# Altium schematic sheet PID.SchDoc
size A2
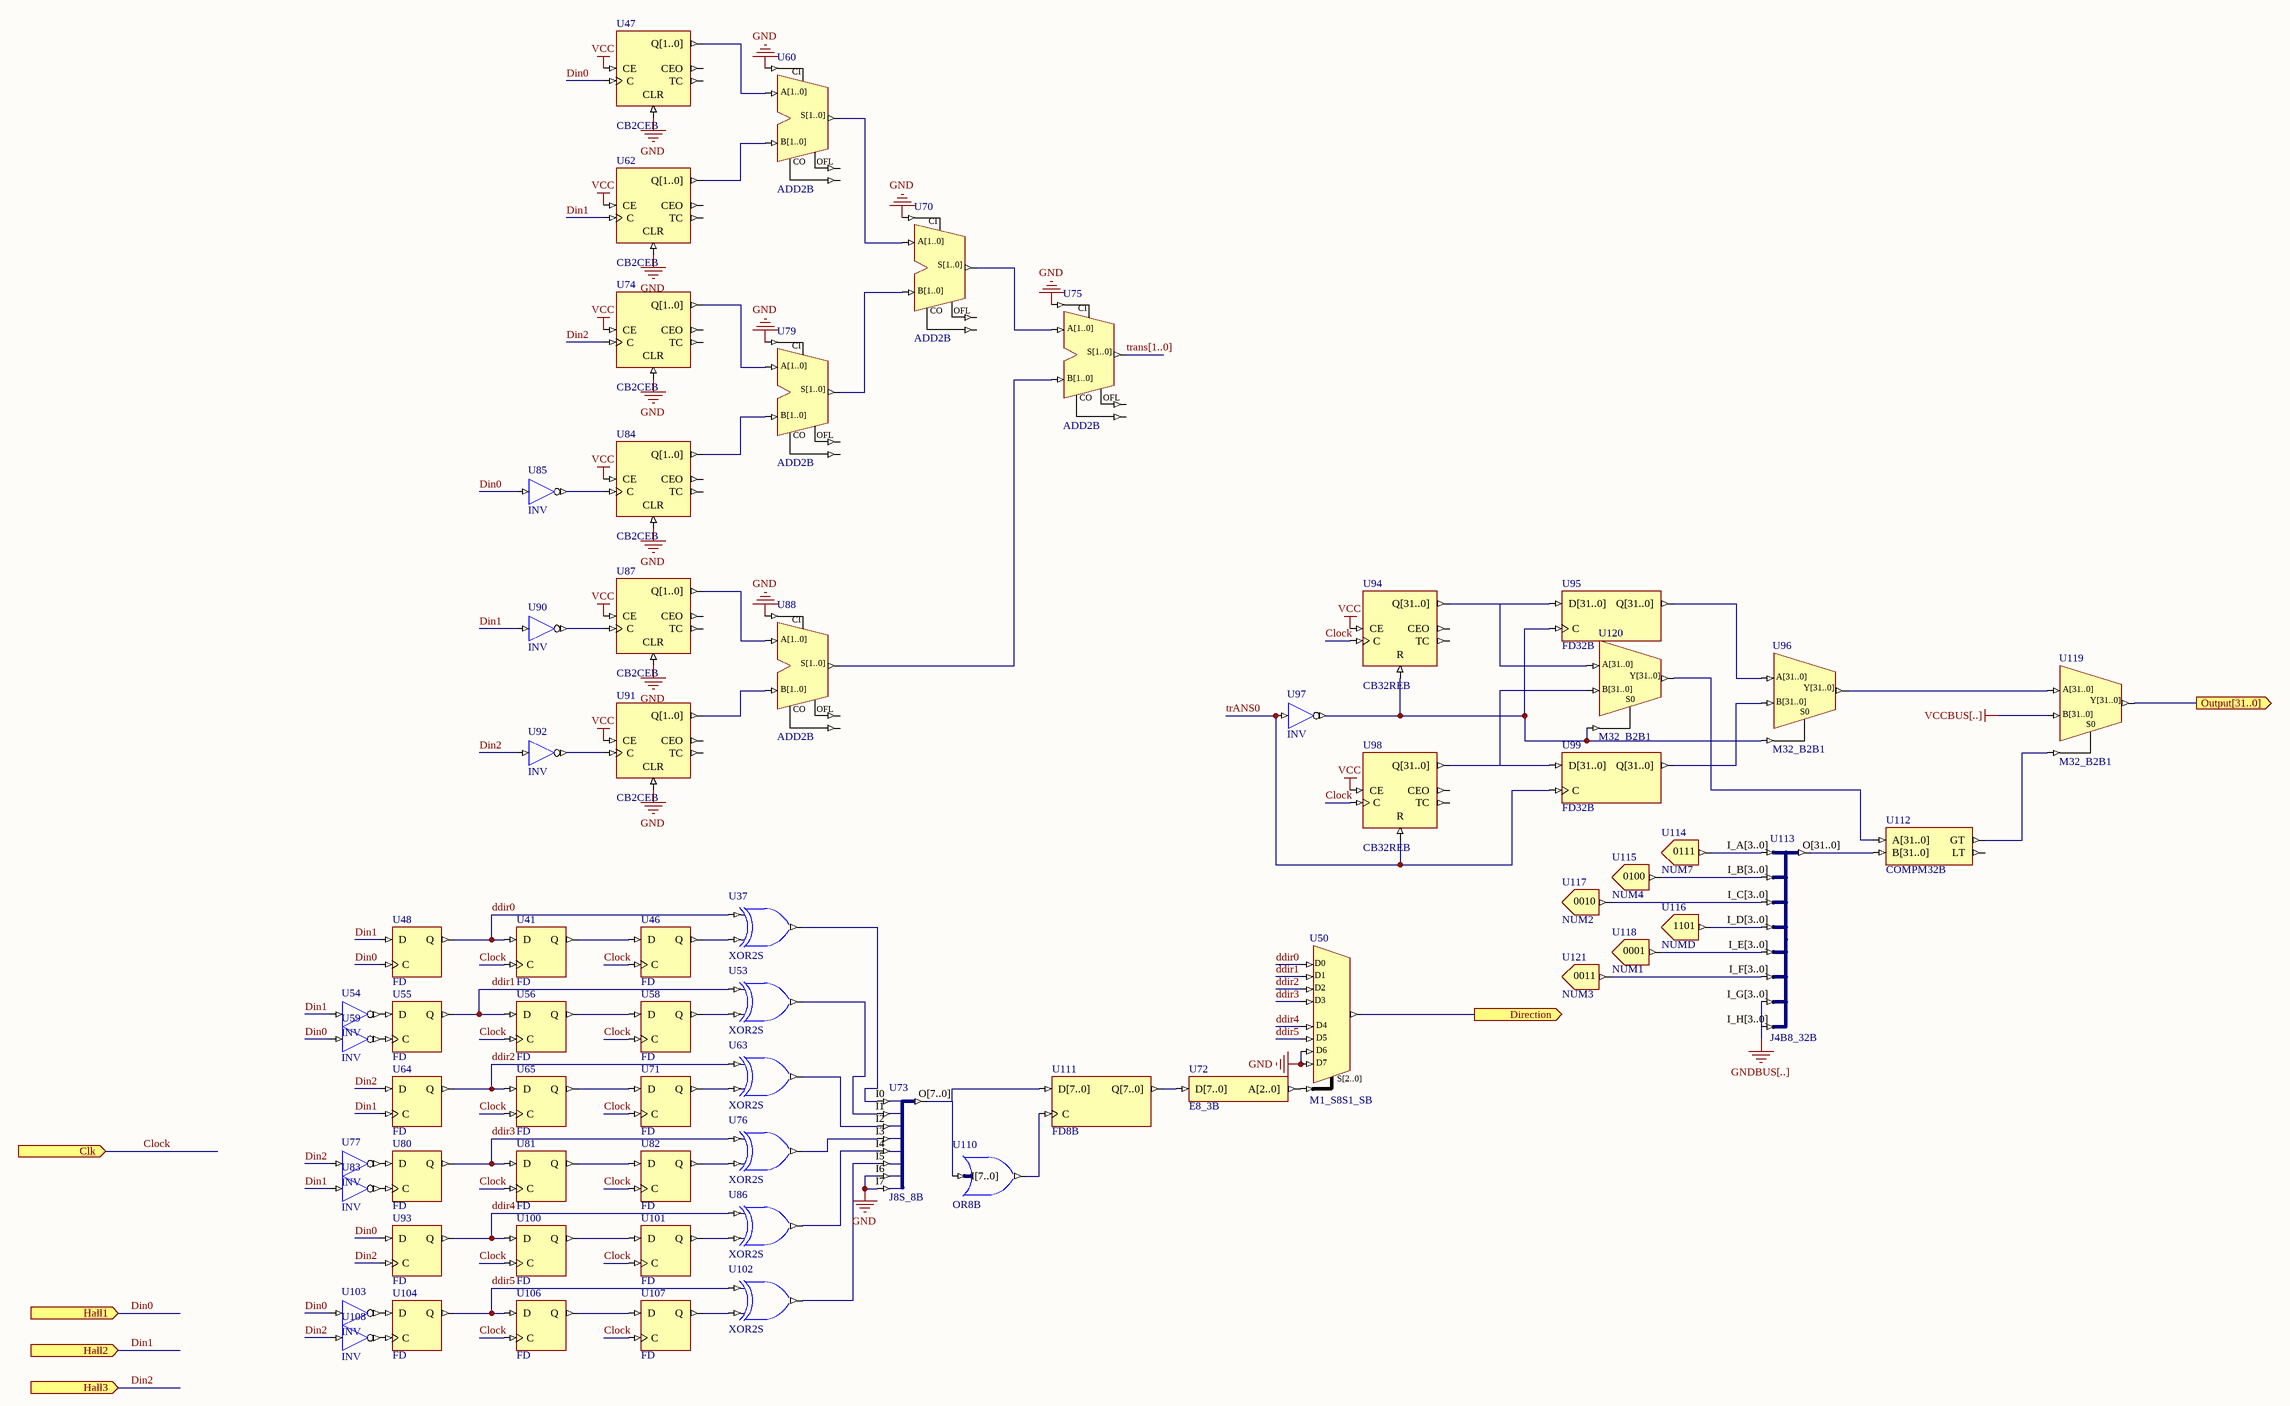
[diagram p0: PID.SchDoc]

## Parts
U37  XOR2S
U41  FD
U46  FD
U47  CB2CEB
U48  FD
U50  M1_S8S1_SB
U53  XOR2S
U54  INV
U55  FD
U56  FD
U58  FD
U59  INV
U60  ADD2B
U62  CB2CEB
U63  XOR2S
U64  FD
U65  FD
U70  ADD2B
U71  FD
U72  E8_3B
U73  J8S_8B
U74  CB2CEB
U75  ADD2B
U76  XOR2S
U77  INV
U79  ADD2B
U80  FD
U81  FD
U82  FD
U83  INV
U84  CB2CEB
U85  INV
U86  XOR2S
U87  CB2CEB
U88  ADD2B
U90  INV
U91  CB2CEB
U92  INV
U93  FD
U94  CB32REB
U95  FD32B
U96  M32_B2B1
U97  INV
U98  CB32REB
U99  FD32B
U100  FD
U101  FD
U102  XOR2S
U103  INV
U104  FD
U106  FD
U107  FD
U108  INV
U110  OR8B
U111  FD8B
U112  COMPM32B
U113  J4B8_32B
U114  NUM7
U115  NUM4
U116  NUMD
U117  NUM2
U118  NUM1
U119  M32_B2B1
U120  M32_B2B1
U121  NUM3

## Ports
Clk (in), Direction (out), Hall1 (in), Hall2 (in), Hall3 (in), Output[31..0] (out)

## Nets
GND: U47.CLR U50.D6 U50.D7 U60.CI U62.CLR U70.CI U73.I6 U73.I7 U74.CLR U75.CI U79.CI U84.CLR U87.CLR U88.CI U91.CLR
GNDBUS[..]: U113.I_G[3..0] U113.I_H[3..0]
VCC: U47.CE U62.CE U74.CE U84.CE U87.CE U91.CE U94.CE U98.CE
VCCBUS[..]: U119.B[31..0]
Clock: U41.C U46.C U56.C U58.C U65.C U71.C U81.C U82.C U94.C U98.C U100.C U101.C U106.C U107.C ; port Clk
ddir0: U37.I0 U41.D U48.Q U50.D0
ddir1: U50.D1 U53.I0 U55.Q U56.D
ddir2: U50.D2 U63.I0 U64.Q U65.D
ddir3: U50.D3 U76.I0 U80.Q U81.D
ddir4: U50.D4 U86.I0 U93.Q U100.D
ddir5: U50.D5 U102.I0 U104.Q U106.D
Din0: U47.C U48.C U59.I U85.I U93.D U103.I ; port Hall1
Din1: U48.D U54.I U62.C U64.C U83.I U90.I ; port Hall2
Din2: U64.D U74.C U77.I U92.I U93.C U108.I ; port Hall3
Direction: U50.O ; port Direction
Output[31..0]: U119.Y[31..0] ; port Output[31..0]
trANS0: U97.I U98.R U99.C
trans[1..0]: U75.S[1..0]
NetU37_I1: U37.I1 U46.Q
NetU37_O: U37.O U73.I0
NetU41_Q: U41.Q U46.D
NetU47_Q[1..0]: U47.Q[1..0] U60.A[1..0]
NetU50_S[2..0]: U50.S[2..0] U72.A[2..0]
NetU53_I1: U53.I1 U58.Q
NetU53_O: U53.O U73.I1
NetU54_O: U54.O U55.D
NetU55_C: U55.C U59.O
NetU56_Q: U56.Q U58.D
NetU60_B[1..0]: U60.B[1..0] U62.Q[1..0]
NetU60_S[1..0]: U60.S[1..0] U70.A[1..0]
NetU63_I1: U63.I1 U71.Q
NetU63_O: U63.O U73.I2
NetU65_Q: U65.Q U71.D
NetU70_B[1..0]: U70.B[1..0] U79.S[1..0]
NetU70_S[1..0]: U70.S[1..0] U75.A[1..0]
NetU72_D[7..0]: U72.D[7..0] U111.Q[7..0]
NetU73_I3: U73.I3 U76.O
NetU73_I4: U73.I4 U86.O
NetU73_I5: U73.I5 U102.O
NetU73_O[7..0]: U73.O[7..0] U110.I[7..0] U111.D[7..0]
NetU74_Q[1..0]: U74.Q[1..0] U79.A[1..0]
NetU75_B[1..0]: U75.B[1..0] U88.S[1..0]
NetU76_I1: U76.I1 U82.Q
NetU77_O: U77.O U80.D
NetU79_B[1..0]: U79.B[1..0] U84.Q[1..0]
NetU80_C: U80.C U83.O
NetU81_Q: U81.Q U82.D
NetU84_C: U84.C U85.O
NetU86_I1: U86.I1 U101.Q
NetU87_C: U87.C U90.O
NetU87_Q[1..0]: U87.Q[1..0] U88.A[1..0]
NetU88_B[1..0]: U88.B[1..0] U91.Q[1..0]
NetU91_C: U91.C U92.O
NetU94_Q[31..0]: U94.Q[31..0] U95.D[31..0] U120.A[31..0]
NetU94_R: U94.R U95.C U96.S0 U97.O U120.S0
NetU95_Q[31..0]: U95.Q[31..0] U96.A[31..0]
NetU96_B[31..0]: U96.B[31..0] U99.Q[31..0]
NetU96_Y[31..0]: U96.Y[31..0] U119.A[31..0]
NetU98_Q[31..0]: U98.Q[31..0] U99.D[31..0] U120.B[31..0]
NetU100_Q: U100.Q U101.D
NetU102_I1: U102.I1 U107.Q
NetU103_O: U103.O U104.D
NetU104_C: U104.C U108.O
NetU106_Q: U106.Q U107.D
NetU110_O: U110.O U111.C
NetU112_A[31..0]: U112.A[31..0] U120.Y[31..0]
NetU112_B[31..0]: U112.B[31..0] U113.O[31..0]
NetU112_GT: U112.GT U119.S0
NetU113_I_A[3..0]: U113.I_A[3..0] U114.O[3..0]
NetU113_I_B[3..0]: U113.I_B[3..0] U115.O[3..0]
NetU113_I_C[3..0]: U113.I_C[3..0] U117.O[3..0]
NetU113_I_D[3..0]: U113.I_D[3..0] U116.O[3..0]
NetU113_I_E[3..0]: U113.I_E[3..0] U118.O[3..0]
NetU113_I_F[3..0]: U113.I_F[3..0] U121.O[3..0]

Not connected (* = marked no-connect by the designer): U47 CEO TC; U60 CO OFL; U62 CEO TC; U70 CO OFL; U74 CEO TC; U75 CO OFL; U79 CO OFL; U84 CEO TC; U87 CEO TC; U88 CO OFL; U91 CEO TC; U94 CEO TC; U98 CEO TC; U112 LT

## Buses and harness runs
bus trans[1..0]

## Notes on the sheet
- (in symbol NUM1) 0001
- (in symbol NUM2) 0010
- (in symbol NUM3) 0011
- (in symbol NUM4) 0100
- (in symbol NUM7) 0111
- (in symbol NUMD) 1101

## Library data of the parts
U37 U53 U63 U76 U86 U102 = XOR2: 2-Input Exclusive-OR Gate, Single Pin Version; XilinxEquivalent: XOR2; FunctionalClass: Logic Primitive; SubClass: XOR; PortSize: 2; ArchiveName: GENERIC; VHDLIB_SIM: GENERIC_LIB; Published: 29-Jan-2004; Publisher: Altium Limited; LastRevisionNo: 1.00.00; HelpURL: CR0118 FPGA Generic Library Guide.pdf#page=448; ComponentLink1URL: CR0136 FPGA Logic Primitive Resource Usage.pdf#page=301; ComponentLink1Description: Core &Resource Usage; PortStyle: Single Pin Version
U41 U46 U48 U55 U56 U58 U64 U65 U71 U80-U82 U93 U100 U101 U104 U106 U107 = FD: D-Type Flip-Flop; ClockTrigger: Rising; ArchiveName: GENERIC; VHDLIB_SIM: GENERIC_LIB; Published: 29-Jan-2004; Publisher: Altium Limited; XilinxEquivalent: FD; LastRevisionNo: 1.00.00; HelpURL: CR0118 FPGA Generic Library Guide.pdf#page=170; ComponentLink1URL: CR0133 FPGA Flip Flop Resource Usage.pdf#page=4; ComponentLink1Description: Core &Resource Usage; FunctionalClass: Flip-Flop; SubClass: FD
U47 U62 U74 U84 U87 U91 = CB2CEB: 2-Bit Cascadable Binary Counters with Clock Enable and Asynchronous Clear, Bus Version; ClockTrigger: Rising; Enable: High; PortSize: 2; ArchiveName: GENERIC; VHDLIB_SIM: GENERIC_LIB; Published: 29-Jan-2004; Publisher: Altium Limited; LastRevisionNo: 1.00.00; HelpURL: CR0118 FPGA Generic Library Guide.pdf#page=128; ComponentLink1URL: CR0130 FPGA Counter Resource Usage.pdf#page=3; ComponentLink1Description: Core &Resource Usage; FunctionalClass: Counter; SubClass: Binary; Reset: Asynchronous; PortType: Bus Version
U50 = M1_S8S1_SB: 8x1-Single Wire to 1x1-Single Wire Multiplexer With Bus Version Select; SubClass: SnS1; BusBusSelect: True; PortSize: 1; PortStyle: Single Pin Version; ArchiveName: GENERIC; VHDLIB_SIM: GENERIC_LIB; Published: 31-May-2004; Publisher: Altium Limited; LastRevisionNo: 1.00.00; HelpURL: CR0118 FPGA Generic Library Guide.pdf#page=379; ComponentLink1URL: CR0137 FPGA Multiplexer Resource Usage.pdf#page=57; ComponentLink1Description: Core &Resource Usage; FunctionalClass: Multiplexer
U54 U59 U77 U83 U85 U90 U92 U97 U103 U108 = INV: Inverter; FunctionalClass: Logic Primitive; ArchiveName: GENERIC; VHDLIB_SIM: GENERIC_LIB; Published: 29-Jan-2004; Publisher: Altium Limited; XilinxEquivalent: INV; LastRevisionNo: 1.00.00; HelpURL: CR0118 FPGA Generic Library Guide.pdf#page=291; ComponentLink1URL: CR0136 FPGA Logic Primitive Resource Usage.pdf#page=61; ComponentLink1Description: Core &Resource Usage; SubClass: INV
U60 U70 U75 U79 U88 = ADD2B: 2-Bit Cascadable Full Adder with Signed and Unsigned Operations, Bus Version; FunctionalClass: Arithmetic Function; SubClass: ADD; PortSize: 2; ArchiveName: GENERIC; VHDLIB_SIM: GENERIC_LIB; Published: 29-Jan-2004; Publisher: Altium Limited; LastRevisionNo: 1.00.00; HelpURL: CR0118 FPGA Generic Library Guide.pdf#page=98; ComponentLink1URL: CR0124 FPGA Arithmetic Function Resource Usage.pdf#page=12; ComponentLink1Description: Core &Resource Usage; PortStyle: Bus Version
U72 = E8_3B: 8- to 3-Bit Priority Encoder, Bus Version; SubClass: n_m; PortSize: 3; ArchiveName: GENERIC; VHDLIB_SIM: GENERIC_LIB; Published: 29-Jan-2004; Publisher: Altium Limited; LastRevisionNo: 1.00.00; HelpURL: CR0118 FPGA Generic Library Guide.pdf#page=164; ComponentLink1URL: CR0132 FPGA Encoder Resource Usage.pdf#page=6; ComponentLink1Description: Core &Resource Usage; FunctionalClass: Encoder; PortStyle: Bus Version
U73 = J8S_8B: 8 Single pin inputs to single 8-Bit output bus; FunctionalClass: Bus Joiner; PortSize: 8; ArchiveName: GENERIC; VHDLIB_SIM: GENERIC_LIB; Published: 29-Jan-2004; Publisher: Altium Limited; LastRevisionNo: 1.00.00; HelpURL: CR0118 FPGA Generic Library Guide.pdf#page=306; ComponentLink1URL: CR0126 FPGA Bus Joiner Resource Usage.pdf#page=28; ComponentLink1Description: Core &Resource Usage
U94 U98 = CB32REB: 32-Bit Cascadable Binary Counter with Clock Enable and Synchronous Reset, Bus Version; ClockTrigger: Rising; Enable: High; PortSize: 32; ArchiveName: GENERIC; VHDLIB_SIM: GENERIC_LIB; Published: 31-May-2004; Publisher: Altium Limited; LastRevisionNo: 1.00.00; HelpURL: CR0118 FPGA Generic Library Guide.pdf#page=134; ComponentLink1URL: CR0130 FPGA Counter Resource Usage.pdf#page=46; ComponentLink1Description: Core &Resource Usage; FunctionalClass: Counter; SubClass: Binary; Reset: Synchronous; PortType: Bus Version
U95 U99 = FD32B: 32-Bit D-Type Flip-Flop, Bus Version; SubClass: FD; ClockTrigger: Rising; PortSize: 32; ArchiveName: GENERIC; VHDLIB_SIM: GENERIC_LIB; Published: 31-May-2004; Publisher: Altium Limited; LastRevisionNo: 1.00.00; HelpURL: CR0118 FPGA Generic Library Guide.pdf#page=170; ComponentLink1URL: CR0133 FPGA Flip Flop Resource Usage.pdf#page=133; ComponentLink1Description: Core &Resource Usage; FunctionalClass: Flip-Flop; PortStyle: Bus Version
U96 U119 U120 = M32_B2B1: 2x32-Bit Bus to 1x32-Bit Bus Multiplexer; SubClass: BnB1; PortSize: 32; PortStyle: Bus Version; ArchiveName: GENERIC; VHDLIB_SIM: GENERIC_LIB; Published: 29-Jan-2004; Publisher: Altium Limited; LastRevisionNo: 1.00.00; HelpURL: CR0118 FPGA Generic Library Guide.pdf#page=364; ComponentLink1URL: CR0137 FPGA Multiplexer Resource Usage.pdf#page=446; ComponentLink1Description: Core &Resource Usage; FunctionalClass: Multiplexer
U110 = OR8B: 8-Input OR Gate, Bus Version; FunctionalClass: Logic Primitive; PortSize: 8; ArchiveName: GENERIC; VHDLIB_SIM: GENERIC_LIB; Published: 29-Jan-2004; Publisher: Altium Limited; LastRevisionNo: 1.00.00; HelpURL: CR0118 FPGA Generic Library Guide.pdf#page=410; ComponentLink1URL: CR0136 FPGA Logic Primitive Resource Usage.pdf#page=229; ComponentLink1Description: Core &Resource Usage; SubClass: OR; PortStyle: Bus Version
U111 = FD8B: 8-Bit D-Type Flip-Flop, Bus Version; XilinxEquivalent: FD8; SubClass: FD; ClockTrigger: Rising; PortSize: 8; ArchiveName: GENERIC; VHDLIB_SIM: GENERIC_LIB; Published: 29-Jan-2004; Publisher: Altium Limited; LastRevisionNo: 1.00.00; HelpURL: CR0118 FPGA Generic Library Guide.pdf#page=170; ComponentLink1URL: CR0133 FPGA Flip Flop Resource Usage.pdf#page=69; ComponentLink1Description: Core &Resource Usage; FunctionalClass: Flip-Flop; PortStyle: Bus Version
U112 = COMPM32B: 32-Bit Magnitude Comparator, Bus Version; SubClass: COMPM; PortSize: 32; ArchiveName: GENERIC; VHDLIB_SIM: GENERIC_LIB; Published: 31-May-2004; Publisher: Altium Limited; LastRevisionNo: 1.00.00; HelpURL: CR0118 FPGA Generic Library Guide.pdf#page=153; ComponentLink1URL: CR0129 FPGA Comparator Resource Usage.pdf#page=47; ComponentLink1Description: Core &Resource Usage; FunctionalClass: Comparator; PortStyle: Bus Version
U113 = J4B8_32B: 8 x 4-Bit input bus to 1 x 32-bit output bus; FunctionalClass: Bus Joiner; PortSize: 4; ArchiveName: GENERIC; VHDLIB_SIM: GENERIC_LIB; Published: 29-Jan-2004; Publisher: Altium Limited; LastRevisionNo: 1.00.00; HelpURL: CR0118 FPGA Generic Library Guide.pdf#page=302; ComponentLink1URL: CR0126 FPGA Bus Joiner Resource Usage.pdf#page=8; ComponentLink1Description: Core &Resource Usage
U114 = NUM7: Number Connector 7; FunctionalClass: Numeric Connector; SubClass: 7; PortSize: 4; PortStyle: Bus Version; ArchiveName: GENERIC; VHDLIB_SIM: GENERIC_LIB; Published: 29-Jan-2004; Publisher: Altium Limited; LastRevisionNo: 1.00.00; HelpURL: CR0118 FPGA Generic Library Guide.pdf#page=409; ComponentLink1URL: CR0138 FPGA Numeric Connector Resource Usage.pdf#page=9; ComponentLink1Description: Core &Resource Usage
U115 = NUM4: Number Connector 4; FunctionalClass: Numeric Connector; SubClass: 4; PortStyle: Bus Version; ArchiveName: GENERIC; VHDLIB_SIM: GENERIC_LIB; Published: 29-Jan-2004; Publisher: Altium Limited; LastRevisionNo: 1.00.00; HelpURL: CR0118 FPGA Generic Library Guide.pdf#page=409; ComponentLink1URL: CR0138 FPGA Numeric Connector Resource Usage.pdf#page=6; ComponentLink1Description: Core &Resource Usage; PortSize: 4
U116 = NUMD: Number Connector D; FunctionalClass: Numeric Connector; PortSize: 4; PortStyle: Bus Version; ArchiveName: GENERIC; VHDLIB_SIM: GENERIC_LIB; Published: 29-Jan-2004; Publisher: Altium Limited; LastRevisionNo: 1.00.00; HelpURL: CR0118 FPGA Generic Library Guide.pdf#page=409; ComponentLink1URL: CR0138 FPGA Numeric Connector Resource Usage.pdf#page=15; ComponentLink1Description: Core &Resource Usage; SubClass: D
U117 = NUM2: Number Connector 2; FunctionalClass: Numeric Connector; SubClass: 2; PortSize: 4; PortStyle: Bus Version; ArchiveName: GENERIC; VHDLIB_SIM: GENERIC_LIB; Published: 29-Jan-2004; Publisher: Altium Limited; LastRevisionNo: 1.00.00; HelpURL: CR0118 FPGA Generic Library Guide.pdf#page=409; ComponentLink1URL: CR0138 FPGA Numeric Connector Resource Usage.pdf#page=4; ComponentLink1Description: Core &Resource Usage
U118 = NUM1: Number Connector 1; FunctionalClass: Numeric Connector; SubClass: 1; PortSize: 4; PortStyle: Bus Version; ArchiveName: GENERIC; VHDLIB_SIM: GENERIC_LIB; Published: 29-Jan-2004; Publisher: Altium Limited; LastRevisionNo: 1.00.00; HelpURL: CR0118 FPGA Generic Library Guide.pdf#page=409; ComponentLink1URL: CR0138 FPGA Numeric Connector Resource Usage.pdf#page=3; ComponentLink1Description: Core &Resource Usage
U121 = NUM3: Number Connector 3; FunctionalClass: Numeric Connector; SubClass: 3; PortSize: 4; PortStyle: Bus Version; ArchiveName: GENERIC; VHDLIB_SIM: GENERIC_LIB; Published: 29-Jan-2004; Publisher: Altium Limited; LastRevisionNo: 1.00.00; HelpURL: CR0118 FPGA Generic Library Guide.pdf#page=409; ComponentLink1URL: CR0138 FPGA Numeric Connector Resource Usage.pdf#page=5; ComponentLink1Description: Core &Resource Usage